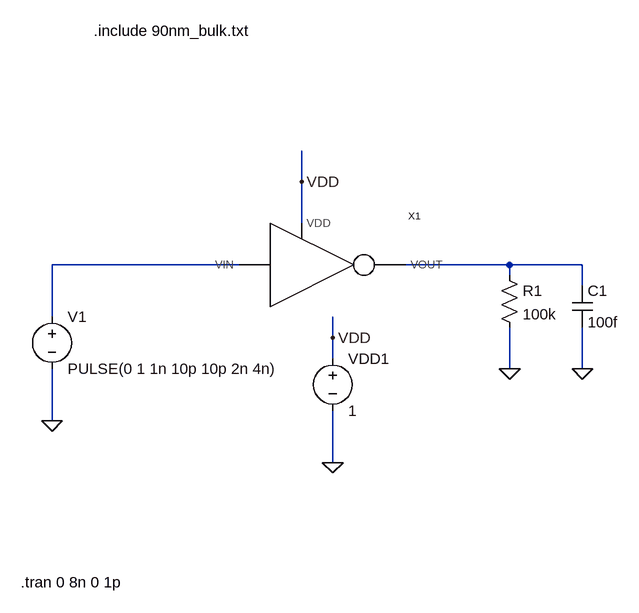
[diagram p0: schematic NOT_tb.asc]
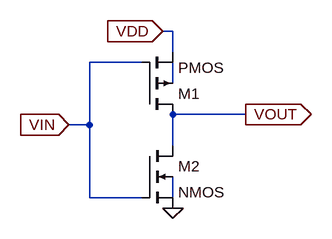
[diagram p1: sub-circuit not.asc]
NOT_tb.asc, the LTspice schematic file:
Version 4
SHEET 1 880 680
WIRE 48 -160 48 -208
WIRE 48 -96 48 -160
WIRE -48 -32 -336 -32
WIRE 368 -32 208 -32
WIRE 480 -32 368 -32
WIRE 368 -16 368 -32
WIRE 480 0 480 -32
WIRE -336 48 -336 -32
WIRE 96 80 96 48
WIRE 96 112 96 80
WIRE 368 128 368 64
WIRE 480 128 480 64
WIRE -336 208 -336 128
WIRE 96 272 96 192
FLAG 96 272 0
FLAG 96 80 VDD
FLAG 368 128 0
FLAG 480 128 0
FLAG 48 -160 VDD
FLAG -336 208 0
SYMBOL voltage -336 32 R0
WINDOW 123 0 0 Left 0
WINDOW 39 0 0 Left 0
SYMATTR InstName V1
SYMATTR Value PULSE(0 1 1n 10p 10p 2n 4n)
SYMBOL res 352 -32 R0
SYMATTR InstName R1
SYMATTR Value 100k
SYMBOL cap 464 0 R0
SYMATTR InstName C1
SYMATTR Value 100f
SYMBOL voltage 96 96 R0
WINDOW 123 0 0 Left 0
WINDOW 39 0 0 Left 0
SYMATTR InstName VDD1
SYMATTR Value 1
SYMBOL NOT 48 -32 R0
SYMATTR InstName X1
TEXT -272 -392 Left 2 !.include 90nm_bulk.txt
TEXT -384 456 Left 2 !.tran 0 8n 0 1p

not.asc, the sub-circuit schematic file:
Version 4
SHEET 1 880 680
WIRE 208 16 192 16
WIRE 208 48 208 16
WIRE 160 64 80 64
WIRE 208 96 208 64
WIRE 320 144 208 144
WIRE 80 160 80 64
WIRE 80 160 48 160
WIRE 208 192 208 144
WIRE 80 272 80 160
WIRE 160 272 80 272
WIRE 208 272 208 240
FLAG 48 160 VIN
IOPIN 48 160 In
FLAG 320 144 VOUT
IOPIN 320 144 Out
FLAG 192 16 VDD
IOPIN 192 16 In
FLAG 208 288 0
SYMBOL pmos4 160 144 M180
SYMATTR InstName M1
SYMATTR Value2 l=90n w=400n
SYMBOL nmos4 160 192 R0
SYMATTR InstName M2
SYMATTR Value2 l=90n w=200n

The netlist it stands for:
* NOT_tb.asc
V1 N001 0 PULSE(0 1 1n 10p 10p 2n 4n)
R1 N002 0 100k
C1 N002 0 100f
VDD1 VDD 0 1
XX1 N001 N002 VDD not

* block symbol definitions
.subckt not VIN VOUT VDD
M1 VOUT VIN VDD N001 PMOS l=90n w=400n
M2 VOUT VIN 0 N002 NMOS l=90n w=200n
.ends not

.model NMOS NMOS
.model PMOS PMOS
.lib standard.mos
.include 90nm_bulk.txt
.tran 0 8n 0 1p
.backanno
.end